# EAGLE design Long LED Graph Shield (EAGLE 5.11)
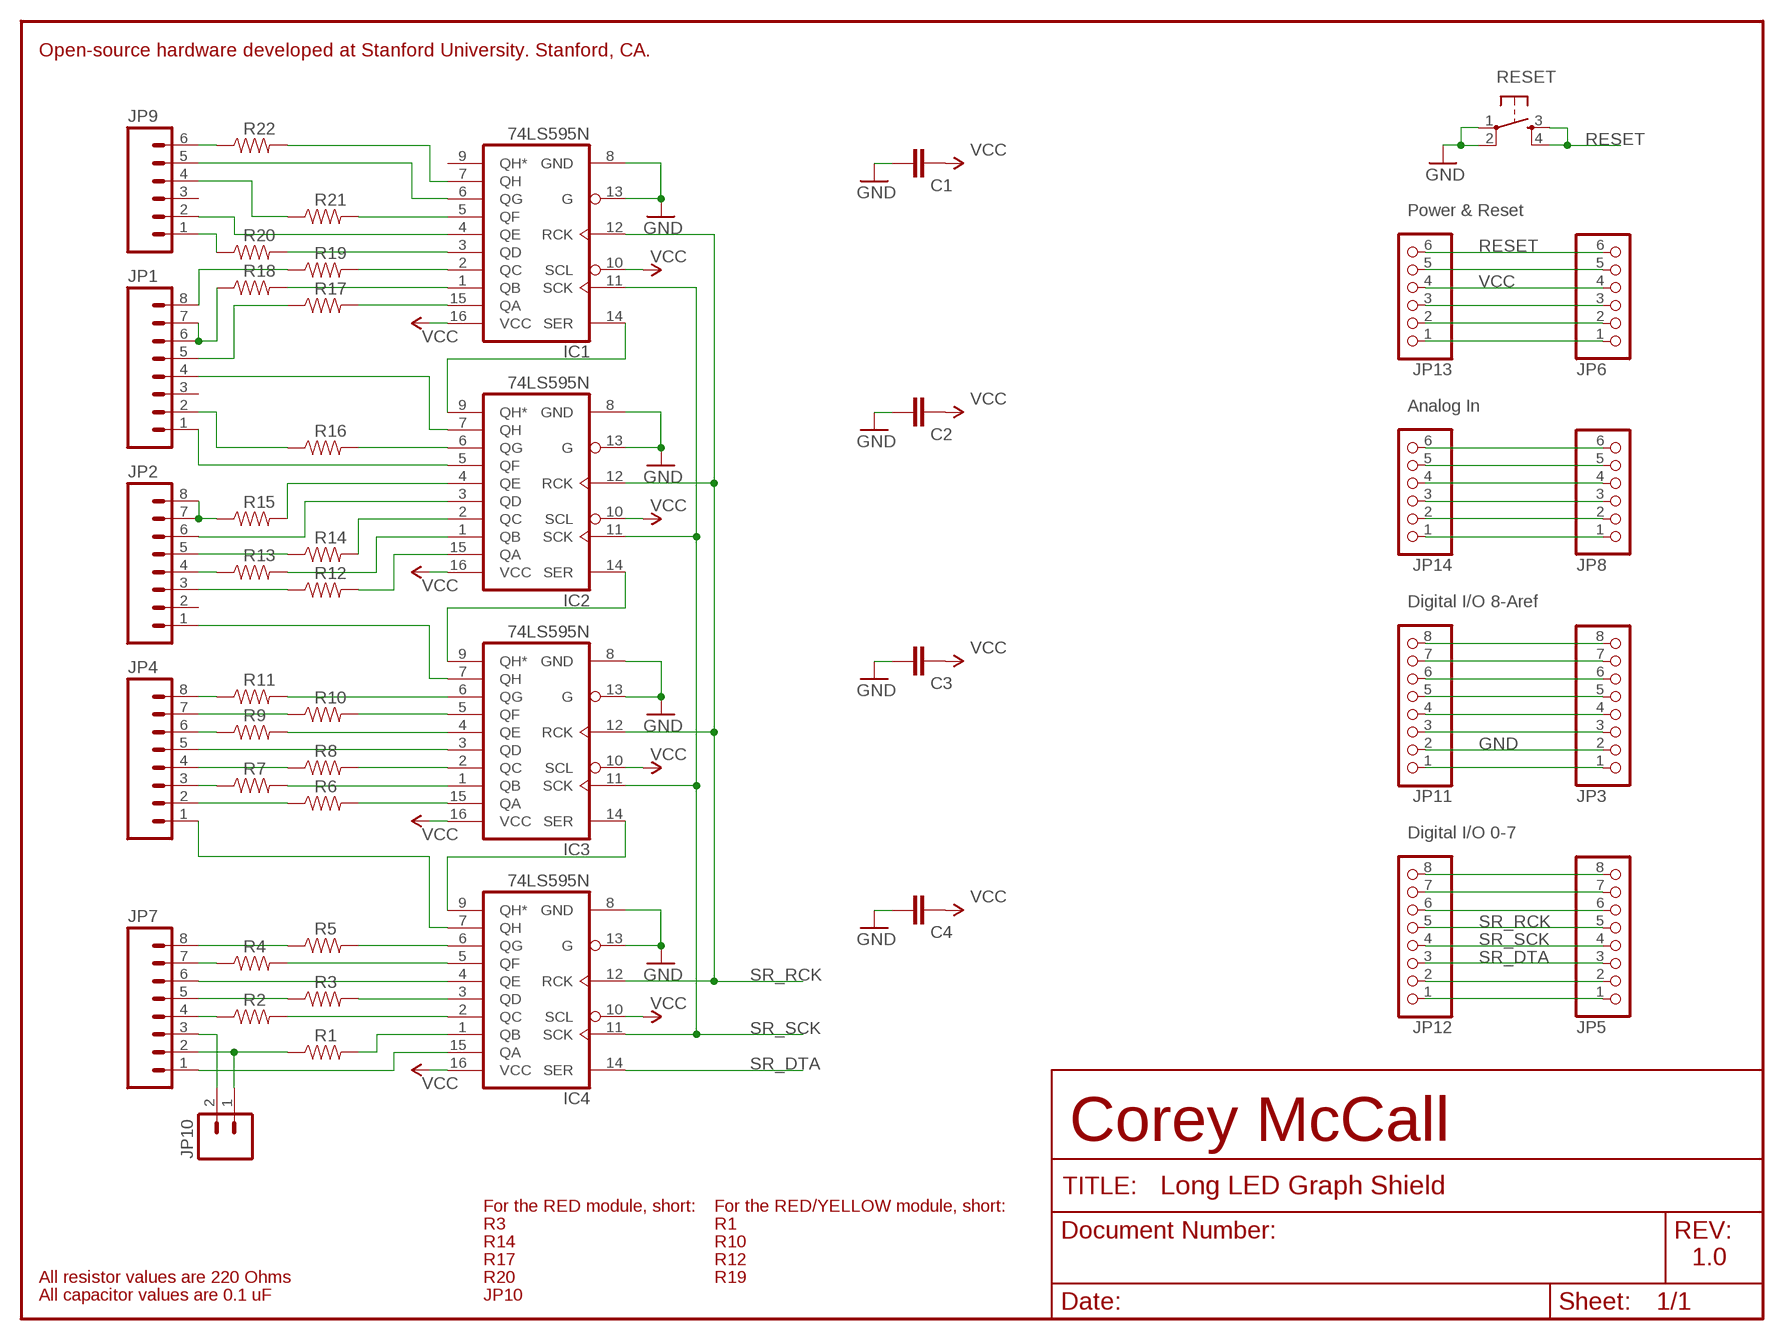
[diagram p0: schematic, sheet 1]

## Parts
C1  .01u  CAPPTH  [CAP-PTH-SMALL]
C2  CAPPTH  [CAP-PTH-SMALL]
C3  CAPPTH  [CAP-PTH-SMALL]
C4  CAPPTH  [CAP-PTH-SMALL]
IC1  74LS595N  [DIL16]
IC2  74LS595N  [DIL16]
IC3  74LS595N  [DIL16]
IC4  74LS595N  [DIL16]
JP1  M081X08  [1X08]
JP2  M081X08  [1X08]
JP3  PINHD-1X8CLEANBIG  [1X08-CLEANBIG]
JP4  M081X08  [1X08]
JP5  PINHD-1X8CLEANBIG  [1X08-CLEANBIG]
JP6  PINHD-1X6CB  [1X06-CLEANBIG]
JP7  M081X08  [1X08]
JP8  PINHD-1X6CB  [1X06-CLEANBIG]
JP9  M06SIP  [1X06]
JP10  M02PTH  [1X02]
JP11  PINHD-1X8CLEANBIG  [1X08-CLEANBIG]
JP12  PINHD-1X8CLEANBIG  [1X08-CLEANBIG]
JP13  PINHD-1X6CB  [1X06-CLEANBIG]
JP14  PINHD-1X6CB  [1X06-CLEANBIG]
R1  RESISTORAXIAL-0.3  [AXIAL-0.3]
R2  RESISTORAXIAL-0.3  [AXIAL-0.3]
R3  RESISTORAXIAL-0.3  [AXIAL-0.3]
R4  RESISTORAXIAL-0.3  [AXIAL-0.3]
R5  RESISTORAXIAL-0.3  [AXIAL-0.3]
R6  RESISTORAXIAL-0.3  [AXIAL-0.3]
R7  RESISTORAXIAL-0.3  [AXIAL-0.3]
R8  RESISTORAXIAL-0.3  [AXIAL-0.3]
R9  RESISTORAXIAL-0.3  [AXIAL-0.3]
R10  RESISTORAXIAL-0.3  [AXIAL-0.3]
R11  RESISTORAXIAL-0.3  [AXIAL-0.3]
R12  RESISTORAXIAL-0.3  [AXIAL-0.3]
R13  RESISTORAXIAL-0.3  [AXIAL-0.3]
R14  RESISTORAXIAL-0.3  [AXIAL-0.3]
R15  RESISTORAXIAL-0.3  [AXIAL-0.3]
R16  RESISTORAXIAL-0.3  [AXIAL-0.3]
R17  RESISTORAXIAL-0.3  [AXIAL-0.3]
R18  RESISTORAXIAL-0.3  [AXIAL-0.3]
R19  RESISTORAXIAL-0.3  [AXIAL-0.3]
R20  RESISTORAXIAL-0.3  [AXIAL-0.3]
R21  RESISTORAXIAL-0.3  [AXIAL-0.3]
R22  RESISTORAXIAL-0.3  [AXIAL-0.3]
RESET  TAC_SWITCHPTH  [TACTILE-PTH]

## Nets
GND: C1.2 C2.2 C3.2 C4.2 IC1.8(GND) IC1.13(G) IC2.8(GND) IC2.13(G) IC3.8(GND) IC3.13(G) IC4.8(GND) IC4.13(G) JP3.2 JP11.2 RESET.1 RESET.2
N$1: IC4.15(QA) JP7.1
N$2: IC4.1(QB) R1.P$2
N$3: JP7.2 JP10.1 R1.P$1
N$4: JP7.3 JP10.2
N$5: IC4.2(QC) R2.P$2
N$6: JP7.4 R2.P$1
N$7: JP7.5 R3.P$1
N$8: IC4.3(QD) R3.P$2
N$9: IC4.4(QE) JP7.6
N$10: IC4.7(QH) JP4.1
N$11: IC4.5(QF) R4.P$2
N$12: JP7.7 R4.P$1
N$13: IC4.6(QG) R5.P$2
N$14: JP7.8 R5.P$1
N$15: IC3.14(SER) IC4.9(QH*)
N$16: JP6.3 JP13.3
N$17: JP6.5 JP13.5
N$18: IC2.14(SER) IC3.9(QH*)
N$19: IC1.14(SER) IC2.9(QH*)
N$20: JP4.4 R8.P$1
N$21: JP6.2 JP13.2
N$22: IC3.15(QA) R6.P$2
N$23: JP4.2 R6.P$1
N$24: JP4.3 R7.P$1
N$25: IC3.1(QB) R7.P$2
N$26: IC3.2(QC) R8.P$2
N$27: IC3.3(QD) JP4.5
N$28: JP4.6 R9.P$1
N$29: IC3.4(QE) R9.P$2
N$30: IC3.5(QF) R10.P$2
N$31: JP4.7 R10.P$1
N$32: JP4.8 R11.P$1
N$33: IC3.6(QG) R11.P$2
N$34: IC3.7(QH) JP2.1
N$35: IC2.1(QB) R13.P$2
N$36: JP2.3 R12.P$1
N$37: JP2.4 R13.P$1
N$38: IC2.15(QA) R12.P$2
N$39: IC2.2(QC) R14.P$2
N$40: JP2.5 R14.P$1
N$41: IC2.3(QD) JP2.6
N$42: JP2.7 JP2.8 R15.P$1
N$43: IC2.4(QE) R15.P$2
N$44: IC2.5(QF) JP1.1
N$45: IC2.6(QG) R16.P$2
N$46: JP1.2 R16.P$1
N$47: IC2.7(QH) JP1.4
N$48: IC1.15(QA) R17.P$2
N$49: JP1.5 R17.P$1
N$50: IC1.1(QB) R18.P$2
N$51: JP1.6 JP1.7 R18.P$1
N$52: IC1.2(QC) R19.P$2
N$53: JP1.8 R19.P$1
N$54: IC1.3(QD) R20.P$2
N$55: JP9.1 R20.P$1
N$56: IC1.4(QE) JP9.2
N$57: IC1.5(QF) R21.P$2
N$58: JP9.4 R21.P$1
N$59: IC1.6(QG) JP9.5
N$60: JP9.6 R22.P$1
N$61: IC1.7(QH) R22.P$2
N$64: JP6.1 JP13.1
N$65: JP3.8 JP11.8
N$66: JP3.7 JP11.7
N$67: JP3.6 JP11.6
N$68: JP3.5 JP11.5
N$69: JP3.4 JP11.4
N$70: JP3.3 JP11.3
N$72: JP3.1 JP11.1
N$73: JP8.6 JP14.6
N$74: JP8.5 JP14.5
N$75: JP8.4 JP14.4
N$76: JP8.3 JP14.3
N$77: JP8.2 JP14.2
N$78: JP8.1 JP14.1
N$79: JP5.8 JP12.8
N$80: JP5.7 JP12.7
N$81: JP5.6 JP12.6
N$85: JP5.2 JP12.2
N$86: JP5.1 JP12.1
RESET: JP6.6 JP13.6 RESET.3 RESET.4
SR_DTA: IC4.14(SER) JP5.3 JP12.3
SR_RCK: IC1.12(RCK) IC2.12(RCK) IC3.12(RCK) IC4.12(RCK) JP5.5 JP12.5
SR_SCK: IC1.11(SCK) IC2.11(SCK) IC3.11(SCK) IC4.11(SCK) JP5.4 JP12.4
VCC: C1.1 C2.1 C3.1 C4.1 IC1.10(SCL) IC1.16(VCC) IC2.10(SCL) IC2.16(VCC) IC3.10(SCL) IC3.16(VCC) IC4.10(SCL) IC4.16(VCC) JP6.4 JP13.4
Unconnected: IC1.9(QH*) JP1.3 JP2.2 JP9.3

## Notes on the sheet
- Open-source hardware developed at Stanford University. Stanford, CA.
- Power & Reset
- Analog In
- Digital I/O 8-Aref
- Digital I/O 0-7
- Corey McCall
- For the RED module, short: | For the RED/YELLOW module, short:
- R3 | R1
- R14 | R10
- R17 | R12 | 1.0
- All resistor values are 220 Ohms | R20 | R19
- All capacitor values are 0.1 uF | JP10

## Library data of the parts
C1-C4 = SparkFun:CAP: Capacitor Standard 0603 ceramic capacitor, and 0.1" leaded capacitor.
IC1-IC4 = SparkFun:74*595: 8-bit SHIFT REGISTER, output latch
JP1 JP2 JP4 JP7 = SparkFun:M08: Header 8 Standard 8-pin 0.1" header. Use with straight break away headers (SKU : PRT-00116), right angle break away headers (PRT-00553), swiss pins (PRT-00743), machine pins (PRT-00117), and female headers (PRT-00115).
JP3 JP5 JP11 JP12 = carduino:PINHD-1X8: PIN HEADER
JP6 JP8 JP13 JP14 = carduino:PINHD-1X6: PIN HEADER
JP9 = SparkFun:M06: Header 6 Standard 6-pin 0.1" header. Use with straight break away headers (SKU : PRT-00116), right angle break away headers (PRT-00553), swiss pins (PRT-00743), machine pins (PRT-00117), and female headers (PRT-00115). Molex polarized connector foot print use with SKU : PRT-08094 with associated crimp pins and housings. NOTES ON THE VARIANTS LOCK and LOCK_LONGPADS... This footprint was designed to help hold the alignment of a through-hole component (i.e. 6-pin header) while soldering it into place. You may notice that each hole has been shifted either up or down by 0.005 of an inch from it's more standard position (which is a perfectly straight line). This slight alteration caused the pins (the squares in the middle) to touch the edges of the holes. Because they are alternating, it causes a "brace" to hold the component in place. 0.005 has proven to be the perfect amount of "off-center" position when using our standard breakaway headers. Although looks a little odd when you look at the bare footprint, once you have a header in there, the alteration is very hard to notice. Also, if you push a header all the way into place, it is covered up entirely on the bottom side. This idea of altering the position of holes to aid alignment will be further integrated into the Sparkfun Library for other footprints. It can help hold any component with 3 or more connection pins.
JP10 = SparkFun:M02: Header 2 Standard 2-pin 0.1" header. Use with straight break away headers (SKU : PRT-00116), right angle break away headers (PRT-00553), swiss pins (PRT-00743), machine pins (PRT-00117), and female headers (PRT-00115). Molex polarized connector foot print use with SKU : PRT-08233 with associated crimp pins and housings.
R1-R22 = SparkFun:RESISTOR: Resistor Basic schematic elements and footprints for 0603, 1206, and PTH resistors.
RESET = SparkFun:TAC_SWITCH: Momentary Switch Button commonly used for reset or general input. Spark Fun Electronics SKU : COM-00097

## Board
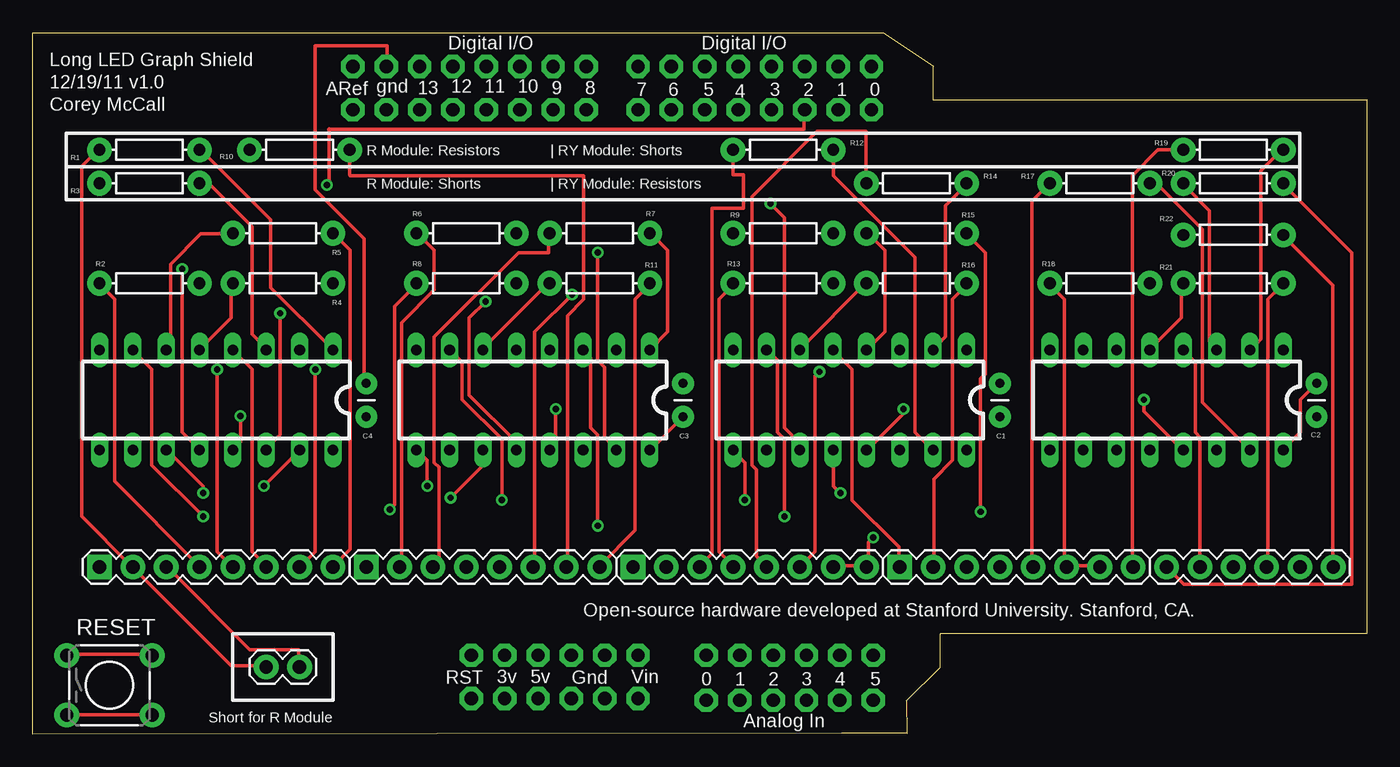
[diagram p1: board, top side]
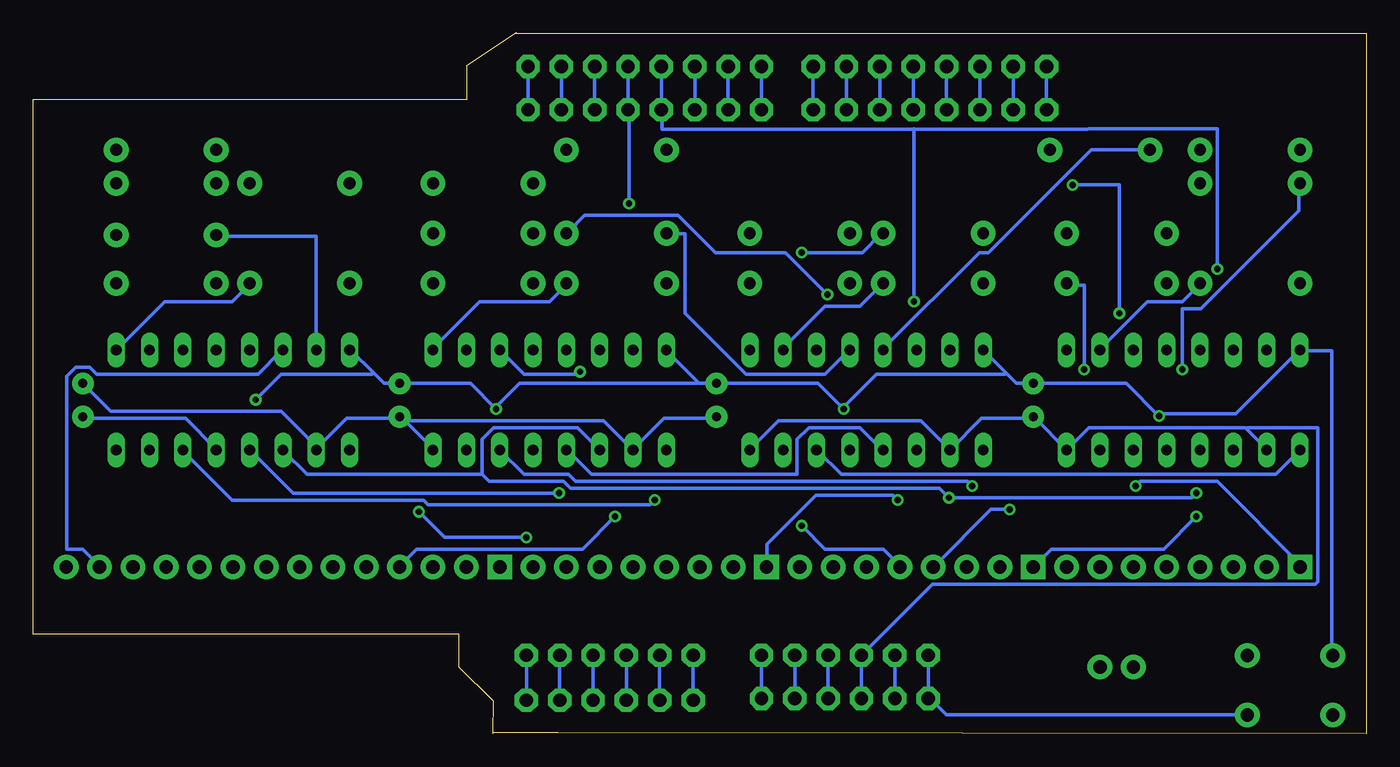
[diagram p2: board, bottom side, seen from below]

Size 101.6 x 53.37 mm. Coordinates in mm from the lower left corner, seen from the top.
Outline: 64.83,53.35 0,53.35 0,0 61.6,0.09 66.58,0.08
Outline: 64.8,53.37 68.59,50.81
Outline: 69.13,5.05 66.55,2.5 66.57,0
Outline: 69.13,5.04 69.13,5.04 69.13,7.63
Outline: 69.13,7.63 101.6,7.63 101.6,48.27 68.58,48.27 68.58,50.81
Copper layers (1*16): Top 0.035mm / dielectric 1.5mm / Bottom 0.035mm
Design rules "default": minimum track width 10mil, minimum drill 19mil, track to track 10mil, track to pad 10mil, pad to pad 0mil, via to via 10mil, smd to smd 0mil, copper to edge 10mil, drill to drill 8mil, minimum pad ring 10mil, minimum via ring 8mil, stop-mask expansion 4mil, vias tented up to drill 0mil, thermal gap 10mil

### Footprints (pad centres in the part's own frame; a part is rotated, then mirrored left to right if it is on the bottom)
CAP-PTH-SMALL = drill 0.7 pad 1.651 round: 1 0,0; 2 2.54,0
DIL16 = drill 0.813 long: 1 -8.89,-3.81; 2 -6.35,-3.81; 3 -3.81,-3.81; 4 -1.27,-3.81; 5 1.27,-3.81; 6 3.81,-3.81; 7 6.35,-3.81; 8 8.89,-3.81; 9 8.89,3.81; 10 6.35,3.81; 11 3.81,3.81; 12 1.27,3.81; 13 -1.27,3.81; 14 -3.81,3.81; 15 -6.35,3.81; 16 -8.89,3.81
1X08 = drill 1.016 pad 1.88 square: 1 0,0 | drill 1.016 pad 1.88 round: 2 2.54,0; 3 5.08,0; 4 7.62,0; 5 10.16,0; 6 12.7,0; 7 15.24,0; 8 17.78,0
1X08-CLEANBIG = drill 1.016 pad 1.778 octagon: 1 -8.89,0; 2 -6.35,0; 3 -3.81,0; 4 -1.27,0; 5 1.27,0; 6 3.81,0; 7 6.35,0; 8 8.89,0
1X06-CLEANBIG = drill 1.016 pad 1.778 octagon: 1 -6.35,0; 2 -3.81,0; 3 -1.27,0; 4 1.27,0; 5 3.81,0; 6 6.35,0
1X06 = drill 1.016 pad 1.88 round: 1 0,0; 2 2.54,0; 3 5.08,0; 4 7.62,0; 5 10.16,0; 6 12.7,0
1X02 = drill 1.016 pad 1.88 round: 1 0,0; 2 2.54,0
AXIAL-0.3 = drill 0.9 pad 1.88 round: P$1 -3.81,0; P$2 3.81,0
TACTILE-PTH = drill 1.016 pad 1.88 round: 1 -3.251,2.261; 2 3.251,2.261; 3 -3.251,-2.261; 4 3.251,-2.261

### Placement (x,y rotation side)
C1  73.66,24.14 90 top
C2  97.79,26.68 270 top
C3  49.53,24.14 90 top
C4  25.4,24.14 90 top
IC1  86.36,25.41 180 top
IC2  62.23,25.41 180 top
IC3  38.1,25.41 180 top
IC4  13.97,25.41 180 top
JP1  66.04,12.71 0 top
JP2  45.72,12.71 0 top
JP3  33.27,50.81 0 top
JP4  25.4,12.71 0 top
JP5  54.99,50.81 180 top
JP6  39.75,2.67 180 top
JP7  5.08,12.71 0 top
JP8  57.65,2.55 0 top
JP9  86.36,12.71 0 top
JP10  17.78,5.09 0 top
JP11  33.27,47.5 0 top
JP12  54.99,47.5 180 top
JP13  39.75,5.97 180 top
JP14  57.65,5.97 0 top
R1  8.89,44.46 0 top
R2  8.89,34.3 0 top
R3  8.89,41.92 0 top
R4  19.05,34.3 180 top
R5  19.05,38.11 180 top
R6  33.02,38.11 0 top
R7  43.18,38.11 0 top
R8  33.02,34.3 0 top
R9  57.15,38.11 180 top
R10  20.32,44.46 180 top
R11  43.18,34.3 180 top
R12  57.15,44.46 0 top
R13  57.15,34.3 0 top
R14  67.31,41.92 0 top
R15  67.31,38.11 180 top
R16  67.31,34.3 180 top
R17  81.28,41.92 0 top
R18  81.28,34.3 0 top
R19  91.44,44.46 0 top
R20  91.44,41.92 180 top
R21  91.44,34.3 180 top
R22  91.44,37.98 180 top
RESET  5.84,3.69 0 top

### Tracks (layer width: path | path; a pad name or v marks a point on that pad's centre or on a via)
GND  (via drill 0.48)
  Top 0.254: 26.98,50.81 26.98,52.39 21.51,52.39 21.51,41.43 25.24,37.7 25.24,26.68 C4.2 | v66.32,24.72 66.32,24.36 63.65,21.7 IC2.13 | v84.63,25.43 84.63,24.54 87.47,21.7 IC1.13 | v39.82,24.72 39.82,22.05 IC3.13 | RESET.1 2.66,6.05 9.06,6.05 RESET.2 | v15.82,24.19 15.82,22.23 15.29,21.7 IC4.13
  Top 0.406: 26.98,50.81 JP3.2
  Bottom 0.254: JP3.2 JP11.2 | IC1.13 87.65,21.7 89.96,24.01 97.79,24.01 C2.2 | 75.65,27.48 74.85,26.68 C1.2 68.27,26.68 v66.32,24.72 66.32,24.9 64.54,26.68 51.03,26.68 50.94,26.76 | 75.65,27.48 77.34,29.16 IC1.8 | v84.63,25.43 82.67,27.39 75.74,27.39 75.65,27.48 | 50.94,26.76 50.85,26.68 C3.2 41.78,26.68 v39.82,24.72 39.82,24.9 37.33,27.39 27.56,27.39 27.47,27.48 | 50.94,26.76 53.34,29.16 IC2.8 | 27.47,27.48 26.67,26.68 C4.2 18.31,26.68 v15.82,24.19 15.82,24.36 9.95,24.36 5.15,29.16 IC4.8 4.97,29.16 2.66,29.16 2.66,6.05 RESET.1 | 27.47,27.48 IC3.8
N$1  (via drill 0.48)
  Top 0.254: v17.6,18.85 20.27,21.52 IC4.15
  Bottom 0.254: v17.6,18.85 17.24,19.21 11.38,19.21 4.97,12.81 JP7.1
N$2
  Top 0.254: IC4.1 22.75,29.34 18.13,33.97 18.13,39.12 12.8,44.46 R1.P$2
N$3
  Top 0.254: JP10.1 17.78,5.16 15.11,5.16 7.64,12.63 JP7.2 7.46,12.81 3.73,16.54 3.73,43.21 4.97,44.46 R1.P$1
N$4
  Top 0.254: JP7.3 10.31,12.63 16.53,6.41 20.27,6.41 20.27,5.16 JP10.2
N$5
  Bottom 0.254: IC4.2 20.27,29.34 16.71,32.9 14.04,32.9 12.8,34.14 R2.P$2
N$6
  Top 0.254: JP7.4 12.62,12.81 6.22,19.21 6.22,33.08 5.15,34.14 R2.P$1
N$7  (via drill 0.48)
  Top 0.254: v14.04,27.74 14.04,13.87 15.11,12.81 JP7.5
  Bottom 0.254: v14.04,27.74 14.04,32.37 12.62,32.37 5.15,39.83 5.15,41.79 R3.P$1
N$8
  Top 0.254: IC4.3 17.78,29.34 16.71,30.41 16.71,38.59 13.51,41.79 12.8,41.79 R3.P$2
N$9
  Top 0.254: IC4.4 16.71,27.74 16.71,13.87 17.78,12.81 JP7.6
N$10  (via drill 0.48)
  Top 0.254: v12.98,16.54 9.06,20.45 9.06,27.74 7.64,29.16 IC4.7
  Bottom 0.254: v12.98,16.54 15.47,14.05 24,14.05 25.24,12.81 JP4.1
N$11
  Top 0.254: IC4.5 12.8,29.34 15.11,31.65 15.11,34.14 R4.P$2
N$12  (via drill 0.48)
  Top 0.254: v21.51,27.74 21.51,13.87 20.44,12.81 JP7.7
  Bottom 0.254: v21.51,27.74 21.51,34.14 22.75,34.14 R4.P$1
N$13
  Top 0.254: IC4.6 10.31,29.34 10.49,29.52 10.49,35.74 12.8,38.05 15.11,38.05 R5.P$2
N$14
  Top 0.254: JP7.8 22.93,12.81 24.18,14.05 24.18,36.81 22.93,38.05 R5.P$1
N$15
  Bottom 0.254: IC4.9 6.93,19.74 40,19.74 41.78,21.52 IC3.14
N$16
  Bottom 0.254: JP6.3 JP13.3
N$17
  Bottom 0.254: JP6.5 JP13.5
N$18  (via drill 0.48)
  Top 0.254: v30.04,18.85 30.04,20.81 29.33,21.52 IC3.9
  Bottom 0.254: v30.04,18.85 30.4,19.21 60.27,19.21 60.8,19.74 64.18,19.74 IC2.14
N$19  (via drill 0.48)
  Top 0.254: v54.23,17.79 54.23,20.63 53.34,21.52 IC2.9
  Bottom 0.254: v54.23,17.79 54.58,17.43 71.47,17.43 71.83,17.79 86.41,17.79 90.14,21.52 IC1.14
N$20  (via drill 0.48)
  Top 0.254: v27.2,17.07 27.56,17.43 27.56,32.54 29.16,34.14 R8.P$1
  Bottom 0.254: v27.2,17.07 28.62,17.07 32.89,12.81 JP4.4
N$21
  Bottom 0.254: JP6.2 JP13.2
N$22  (via drill 0.48)
  Top 0.254: v43.02,36.63 43.02,28.45 43.56,27.92 43.56,22.59 44.45,21.7 IC3.15
  Bottom 0.254: v43.02,36.63 38.4,36.63 36.98,38.05 R6.P$2
N$23
  Top 0.254: JP4.2 28.09,12.81 28.09,31.3 30.58,33.79 30.58,36.81 29.33,38.05 R6.P$1
N$24
  Top 0.254: JP4.3 30.93,13.16 30.93,20.27 30.58,20.63 30.58,30.23 36.98,36.63 39.29,36.63 39.29,38.05 R7.P$1
N$25
  Top 0.254: IC3.1 48.36,30.59 48.36,36.81 47.11,38.05 R7.P$2
N$26
  Bottom 0.254: IC3.2 44.45,29.34 41.25,32.54 38.58,32.54 R8.P$2
N$27  (via drill 0.48)
  Top 0.254: v43.02,15.83 43.02,22.76 42.49,23.3 42.49,28.63 IC3.3
  Bottom 0.254: v43.02,15.83 41.25,14.05 36.8,14.05 35.56,12.81 JP4.5
N$28  (via drill 0.48)
  Top 0.254: v41.07,33.43 38.22,30.59 38.22,12.81 JP4.6
  Bottom 0.254: v41.07,33.43 44.27,36.63 49.6,36.63 52.45,39.48 59.56,39.48 60.8,38.23 R9.P$1
N$29
  Bottom 0.254: IC3.4 39.47,29.16 41.25,27.39 47.29,27.39 51.91,32.01 51.91,38.05 53.34,38.05 R9.P$2
N$30
  Bottom 0.254: IC3.5 36.8,29.34 29.51,36.63 28.8,36.63 20.98,44.46 R10.P$2
N$31
  Top 0.254: JP4.7 40.71,12.81 40.71,31.83 41.96,33.08 41.96,42.5 24.18,42.5 24.13,42.55 R10.P$1
N$32
  Top 0.254: JP4.8 43.2,12.81 45.87,15.47 45.87,33.08 46.94,34.14 R11.P$1
N$33
  Top 0.254: IC3.6 34.31,29.34 39.29,34.32 R11.P$2
N$34  (via drill 0.48)
  Top 0.254: v35.73,17.79 35.73,22.41 32.71,25.43 32.71,28.28 31.82,29.16 IC3.7
  Bottom 0.254: v35.73,17.79 36.09,18.14 41.96,18.14 45.69,14.41 45.69,12.81 JP2.1
N$35
  Bottom 0.254: IC2.1 71.12,29.34 67.56,32.9 62.23,32.9 60.98,34.14 R13.P$2
N$36
  Top 0.254: JP2.3 50.85,12.81 51.74,13.7 51.74,40.01 54.14,40.01 54.14,42.55 53.34,42.55 R12.P$1
N$37
  Top 0.254: JP2.4 53.34,12.81 52.27,13.87 52.27,33.08 53.34,34.14 R13.P$1
N$38
  Top 0.254: IC2.15 68.45,21.7 67.2,22.94 67.2,36.28 60.98,42.5 60.98,44.46 R12.P$2
N$39
  Top 0.254: IC2.2 68.63,29.34 69.52,30.23 69.52,40.19 71.12,41.79 R14.P$2
N$40
  Top 0.254: JP2.5 55.83,12.81 55.11,13.52 55.11,20.1 54.76,20.45 54.76,40.9 59.74,45.88 63.47,45.88 63.47,41.97 R14.P$1
N$41  (via drill 0.48)
  Top 0.254: v59.92,27.56 59.56,27.21 59.56,13.87 58.49,12.81 JP2.6
  Bottom 0.254: v59.92,27.56 60.09,27.39 64.18,27.39 65.96,29.16 IC2.3
N$42  (via drill 0.48)
  Top 0.254: JP2.7 60.98,12.81 63.47,12.81 JP2.8 63.65,12.81 63.65,14.59 v64,14.94 | v72.18,16.9 72.18,27.03 72.54,27.39 72.54,36.63 71.12,38.05 R15.P$1
  Bottom 0.254: v72.18,16.9 70.23,14.94 v64,14.94
N$43
  Top 0.254: IC2.4 63.65,29.34 64.89,30.59 64.89,36.81 63.65,38.05 R15.P$2
N$44
  Top 0.254: IC2.5 60.98,29.16 62.4,27.74 62.4,17.79 65.96,14.23 65.96,12.81 JP1.1
N$45
  Top 0.254: IC2.6 58.49,29.34 63.47,34.32 R16.P$2
N$46
  Top 0.254: JP1.2 68.63,12.81 68.63,19.39 70.05,20.81 70.05,33.08 71.12,34.14 R16.P$1
N$47  (via drill 0.48)
  Top 0.254: v57.25,16.54 57.25,22.41 56.71,22.94 56.71,28.45 56,29.16 IC2.7
  Bottom 0.254: v57.25,16.54 59.74,14.05 72.36,14.05 73.61,12.81 JP1.4
N$48
  Top 0.254: IC1.15 92.63,21.7 89.07,25.25 89.07,38.41 85.7,41.79 85.16,41.79 R17.P$2
N$49
  Top 0.254: JP1.5 76.09,12.81 76.09,40.54 R17.P$1
N$50
  Bottom 0.254: IC1.1 91.56,32.9 86.41,32.9 85.16,34.14 R18.P$2
N$51
  Top 0.254: JP1.7 81.25,12.81 78.76,12.81 JP1.6 78.58,12.81 78.58,33.08 77.52,34.14 R18.P$1
N$52
  Top 0.254: IC1.2 92.81,29.34 93.52,30.05 93.52,42.86 95.12,44.46 R19.P$2
N$53
  Top 0.254: JP1.8 83.74,12.81 83.74,42.5 85.7,44.46 R19.P$1
N$54
  Top 0.254: IC1.3 90.14,29.34 89.61,29.88 89.61,39.83 87.65,41.79 R20.P$2
N$55
  Top 0.254: JP9.1 86.41,12.63 87.65,11.38 100.45,11.38 100.45,36.63 95.3,41.79 R20.P$1
N$56
  Top 0.254: IC1.4 87.65,29.16 88.54,28.28 88.54,22.94 88.9,22.59 JP9.2
N$57
  Top 0.254: IC1.5 85.16,29.34 87.47,31.65 87.47,34.14 R21.P$2
N$58
  Top 0.254: JP9.4 94.05,12.81 94.05,33.08 95.12,34.14 R21.P$1
N$59
  Bottom 0.254: IC1.6 82.67,29.16 84.45,27.39 96.72,27.39 97.25,27.92 98.32,27.92 99.03,27.21 99.03,14.05 97.79,14.05 96.54,12.81 JP9.5
N$60
  Top 0.254: JP9.6 99.03,12.81 99.03,34.14 95.3,37.88 R22.P$1
N$61
  Bottom 0.254: IC1.7 80.01,37.88 87.47,37.88 R22.P$2
N$64
  Bottom 0.254: JP6.1 JP13.1
N$65
  Bottom 0.254: JP11.8 JP3.8
N$66
  Bottom 0.254: JP11.7 JP3.7
N$67
  Bottom 0.254: JP11.6 JP3.6
N$68
  Bottom 0.254: JP11.5 JP3.5
N$69
  Bottom 0.254: JP11.4 JP3.4
N$70
  Bottom 0.254: JP11.3 JP3.3
N$72
  Bottom 0.254: JP11.1 JP3.1
N$73
  Bottom 0.254: JP8.6 JP14.6
N$74
  Bottom 0.254: JP8.5 JP14.5
N$75
  Bottom 0.254: JP8.4 JP14.4
N$76
  Bottom 0.254: JP8.3 JP14.3
N$77
  Bottom 0.254: JP8.2 JP14.2
N$78
  Bottom 0.254: JP8.1 JP14.1
N$79
  Bottom 0.254: JP12.8 JP5.8
N$80
  Bottom 0.254: JP12.7 JP5.7
N$81
  Bottom 0.254: JP12.6 JP5.6
N$85
  Bottom 0.254: JP12.2 JP5.2
N$86
  Bottom 0.254: JP12.1 JP5.1
RESET
  Top 0.254: RESET.3 RESET.4
  Bottom 0.254: JP13.6 JP6.6 33.25,2.67 32,1.43 RESET.4
SR_DTA  (via drill 0.48)
  Top 0.254: 58.73,47.5 58.73,46.04 22.58,46.04 | 22.58,46.04 22.54,46.04 | v18.84,32.01 18.84,22.76 17.78,21.7 IC4.14 | v22.4,41.79 22.58,41.97 22.58,46.04 | 22.58,46.04 22.58,46.06
  Top 0.406: 58.73,47.5 JP12.3
  Bottom 0.254: JP12.3 JP5.3 | v18.84,32.01 18.84,41.79 v22.4,41.79
SR_RCK  (via drill 0.48)
  Top 0.254: v11.38,35.39 11.38,22.94 12.62,21.7 IC4.12 | v61.52,18.32 60.98,18.85 60.98,21.52 IC2.12 | v34.49,32.9 33.25,31.65 33.25,25.79 36.8,22.23 36.8,21.7 IC3.12
  Bottom 0.254: JP12.5 JP5.5 | 53.65,47.5 53.65,46.04 34.49,46.04 | 34.49,46.04 21.27,46.04 21.15,46.06 11.38,46.06 v11.38,35.39 | IC3.12 36.98,21.7 38.58,23.3 42.49,23.3 43.38,22.41 43.38,19.74 59.03,19.74 60.8,21.52 IC2.12 | v61.52,18.32 81.78,18.32 84.98,21.52 IC1.12 | 34.49,46.04 v34.49,32.9 | 34.49,46.04 34.49,46.06
  Bottom 0.406: 53.65,47.5 JP12.5
SR_SCK  (via drill 0.48)
  Top 0.254: v12.98,18.32 12.98,18.85 10.31,21.52 IC4.11 | v31.82,17.96 34.13,20.27 34.13,21.52 IC3.11 | v56.18,40.37 57.25,39.3 57.25,23.3 58.31,22.23 58.31,21.7 IC2.11
  Bottom 0.254: JP12.4 JP5.4 | 56.19,43.21 56.19,43.19 | 56.19,43.21 56.19,47.5 | v12.98,18.32 13.33,17.96 v31.82,17.96 32.53,18.67 60.63,18.67 61.16,19.21 66.85,19.21 67.38,19.74 | 67.38,19.74 67.38,22.41 66.49,23.3 60.09,23.3 58.49,21.7 IC2.11 | 67.38,19.74 80.72,19.74 82.5,21.52 IC1.11 | v56.18,40.37 56.18,43.21 56.19,43.21
  Bottom 0.406: 56.19,47.5 JP12.4
VCC
  Top 0.254: IC3.16 47.11,21.7 49.42,24.01 C3.1 | C2.1 96.54,25.43 96.54,22.94 95.3,21.7 IC1.16
  Bottom 0.254: JP6.4 JP13.4 33.07,11.38 3.91,11.38 3.73,11.56 3.73,23.3 9.06,23.3 9.15,23.21 | 9.15,23.21 9.24,23.3 21.15,23.3 IC4.16 22.93,21.7 25.24,24.01 C4.1 25.42,24.01 29.33,24.01 IC3.10 31.82,21.7 33.96,23.83 44.8,23.83 46.94,21.7 IC3.16 | 9.15,23.21 7.64,21.7 IC4.10 | C3.1 49.6,24.01 53.51,24.01 55.83,21.7 IC2.10 56,21.7 58.14,23.83 73.07,23.83 C1.1 | IC2.16 71.12,21.7 73.43,24.01 73.61,24.01 C1.1 | C1.1 73.78,24.01 77.7,24.01 80.01,21.7 IC1.10 80.01,21.87 82.67,24.54 95.65,24.54 C2.1

### Text on the board
tPlace: Digital I/O | Digital I/O | Long LED Graph Shield | ARef | gnd | 13 | 12 | 11 | 10 | 9 | 8 | 7 | 6 | 5 | 3 | 2 | 1 | 0 | 12/19/11 v1.0 | 4 | Corey McCall | R Module: Resistors | | RY Module: Shorts | R Module: Shorts | | RY Module: Resistors | Open-source hardware developed at Stanford University. Stanford, CA. | RST | 3v | 5v | Vin | Gnd | 0 | 1 | 2 | 3 | 4 | 5 | Short for R Module | Analog In